# Altium schematic sheet Supply Power.SchDoc
size A4; SheetNumber: 1; SheetTotal: 4
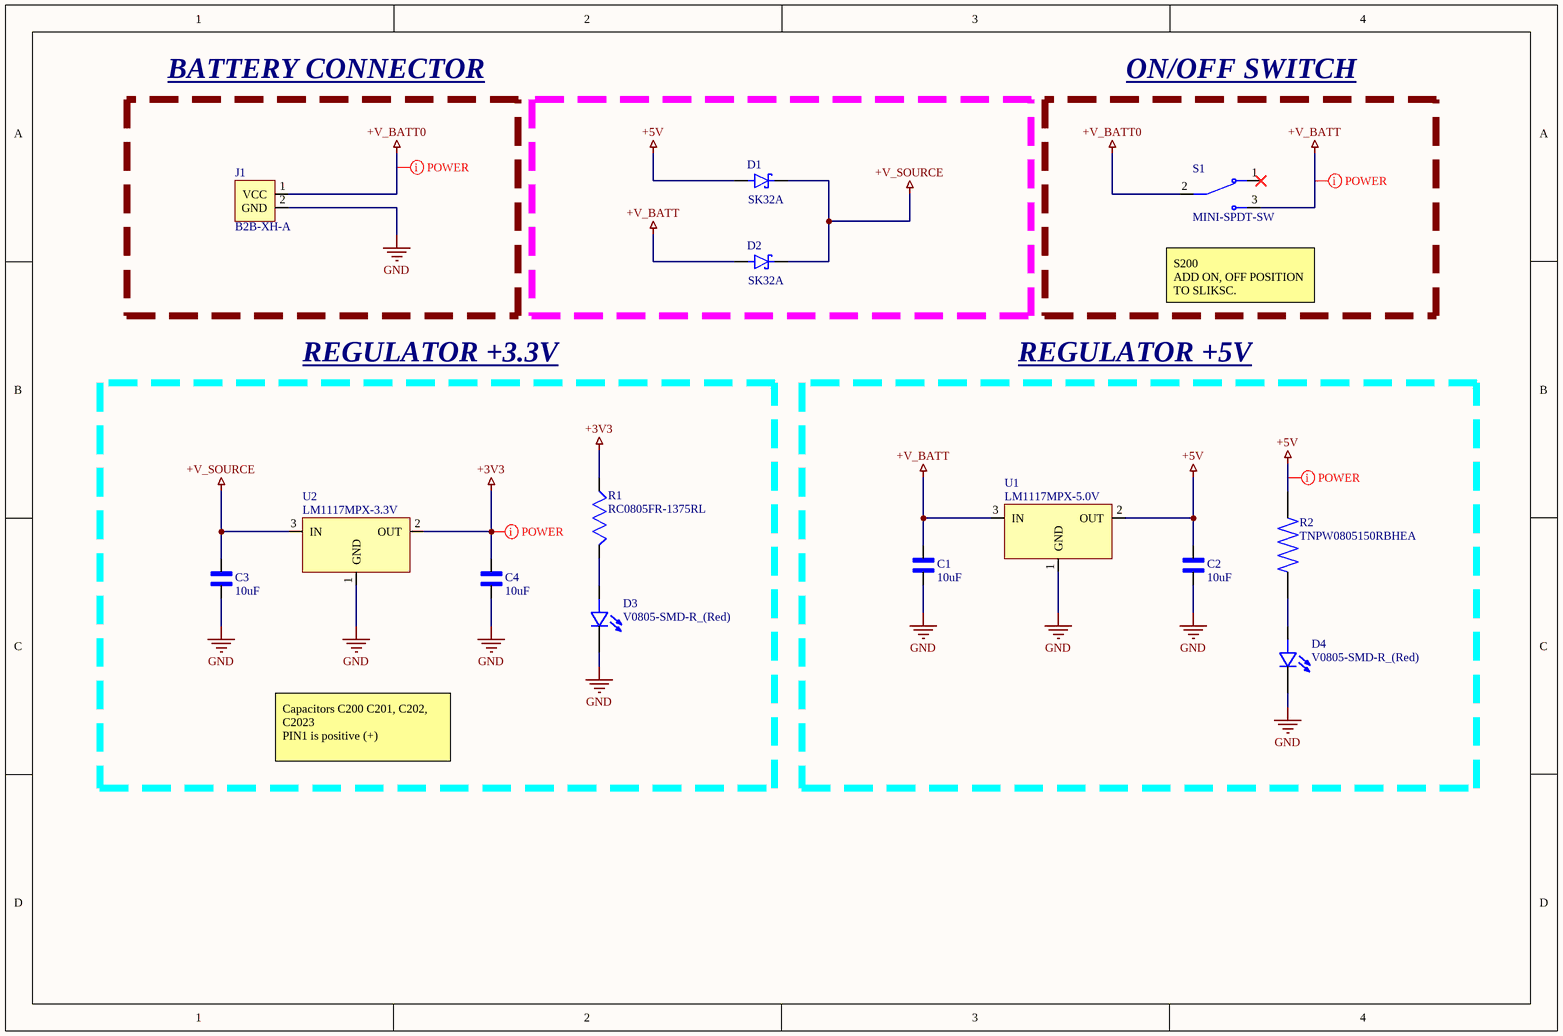
[diagram p0: Supply Power.SchDoc]

## Parts
C1  value 10uF  [CAPPC7343X430N]  (hidden comment: T495D106K035AHE300)
C2  value 10uF  [CAPPC7343X430N]  (hidden comment: T495D106K035AHE300)
C3  value 10uF  [CAPPC7343X430N]  (hidden comment: T495D106K035AHE300)
C4  value 10uF  [CAPPC7343X430N]  (hidden comment: T495D106K035AHE300)
D1  SK32A  [DIOM4325X250N]
D2  SK32A  [DIOM4325X250N]
D3  V0805-SMD-R_(Red)  [LED_V0805-SMD-R (Red)]
D4  V0805-SMD-R_(Red)  [LED_V0805-SMD-R (Red)]
J1  B2B-XH-A  [B2B-XH-A]
R1  RC0805FR-1375RL  [RESC2012X60N]
R2  TNPW0805150RBHEA  [RESC2012X55N]
S1  MINI-SPDT-SW  [SW_MINI-SPDT-SW]
U1  LM1117MPX-5.0V  [SOT230P700X180-4N]
U2  LM1117MPX-3.3V  [SOT230P700X180-4N]

## Blocks framed on the sheet
BATTERY CONNECTOR: J1
ON/OFF SWITCH: S1
REGULATOR +3.3V: C3 C4 D3 R1 U2
REGULATOR +5V: C1 C2 D4 R2 U1

## Nets
+3V3: C4.1 R1.2 U2.2(OUT)
+5V: C2.1 D1.A R2.2 U1.2(OUT)
+V_BATT: C1.1 D2.A S1.3 U1.3(IN)
+V_BATT0: J1.1(VCC) S1.2
+V_SOURCE: C3.1 D1.C(K) D2.C(K) U2.3(IN)
GND: C1.2 C2.2 C3.2 C4.2 D3.1(C) D4.1(C) J1.2(GND) U1.1(GND) U2.1(GND)
NetD3_2: D3.2(A) R1.1
NetD4_2: D4.2(A) R2.1

Not connected (* = marked no-connect by the designer): S1 1*

## Layout directives
net class POWER_Nets: +3V3, +5V, +V_BATT, +V_BATT0

## Notes on the sheet
- (near S1) S200
  ADD ON, OFF POSITION TO SLIKSC.
- Capacitors C200 C201, C202, C2023
  PIN1 is positive (+)

## Library data of the parts
C1-C4 = T495D106K035AHE300: Capacitor,10uF,35VDC,10-% Tol,10+% Tol; MF: {'manufacturer': u'KEMET'}; Package: None; Price: None; MP: T495D106K035AHE300; Availability: Unavailable
D1 D2 = SK32A: MF: {'manufacturer': u'Taiwan Semiconductor'}; Package: None; Price: None; Value: *; MP: SK32A; Availability: Unavailable
D3 D4 = V0805-SMD-R_(Red): V0805 - Valcon 0805 Type Surface Mount LED; MF: {'manufacturer': u'Valcon'}; Package: None; Price: None; Value: *; MP: V0805-SMD-R_(Red); Availability: Unavailable
J1 = B2B-XH-A-2Pin
R1 = RC0805FR-1375RL: MF: {'manufacturer': u'Yageo'}; Package: None; Price: None; Value: *; MP: RC0805FR-1375RL; Availability: Unavailable
R2 = TNPW0805150RBHEA: MF: {'manufacturer': u'Vishay'}; Package: None; Price: None; Value: *; MP: TNPW0805150RBHEA; Availability: Unavailable
S1 = MINI-SPDT-SW: Simple breadboard friendly SPDT slide switch. Rated at 30V/200mA with operating force of 250 +/-100gf.; MF: {'manufacturer': u'Gravitech'}; Package: None; Price: None; Value: *; MP: MINI-SPDT-SW; Availability: Unavailable
U1 = LM1117MPX-5.0V: LM1117MPX-50NOPB; Vout: 5V
U2 = LM1117MPX-3.3V: LM1117MPX-33NOPB; Vout: 5V